# Altium schematic sheet Connectors.SchDoc: Heater Test Board
size OrCAD A; DocumentNumber: LM-HTR-001-TEST; Revision: A; SheetNumber: 1; SheetTotal: 2
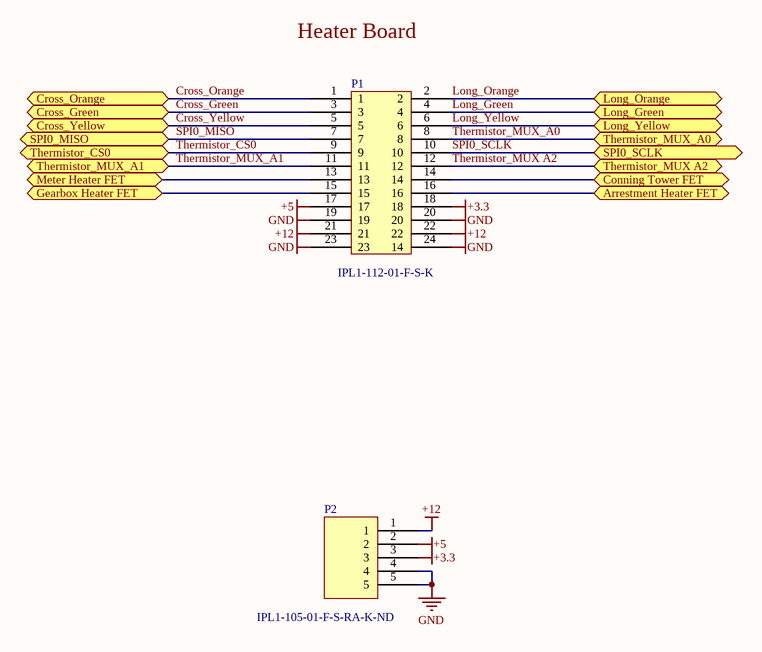
[diagram p0: Connectors.SchDoc]

## Parts
P1  IPL1-112-01-F-S-K  [IPL1-112-01-F-S-K]
P2  Supplier Part Number 1: IPL1-105-01-F-S-RA-K-ND  [IPL1-105-01-F-S-RA]  (hidden comment: IPL1-105-01-F-S-RA)

## Ports
Arrestment Heater FET, Conning Tower FET, Cross_Green, Cross_Orange, Cross_Yellow, Gearbox Heater FET, Long_Green, Long_Orange, Long_Yellow, Meter Heater FET, SPI0_MISO, SPI0_SCLK, Thermistor_CS0, Thermistor_MUX A2, Thermistor_MUX_A0, Thermistor_MUX_A1

## Nets
+3.3: P1.18 P2.3
+5: P1.17 P2.2
+12: P1.21 P1.22 P2.1
GND: P1.19 P1.20 P1.23 P1.24(14) P2.4 P2.5
Arrestment Heater FET: P1.16 ; port Arrestment Heater FET
Conning Tower FET: P1.14 ; port Conning Tower FET
Cross_Green: P1.3 ; port Cross_Green
Cross_Orange: P1.1 ; port Cross_Orange
Cross_Yellow: P1.5 ; port Cross_Yellow
Gearbox Heater FET: P1.15 ; port Gearbox Heater FET
Long_Green: P1.4 ; port Long_Green
Long_Orange: P1.2 ; port Long_Orange
Long_Yellow: P1.6 ; port Long_Yellow
Meter Heater FET: P1.13 ; port Meter Heater FET
SPI0_MISO: P1.7 ; port SPI0_MISO
SPI0_SCLK: P1.10 ; port SPI0_SCLK
Thermistor_CS0: P1.9 ; port Thermistor_CS0
Thermistor_MUX A2: P1.12 ; port Thermistor_MUX A2
Thermistor_MUX_A0: P1.8 ; port Thermistor_MUX_A0
Thermistor_MUX_A1: P1.11 ; port Thermistor_MUX_A1

## Notes on the sheet
- Heater Board
- Title
- Size:
- Date:
- Orcad A
- Number:
- Time:
- Revision:
- Sheet
- of
- ZLS Corporation
- 7801 North Lamar Blvd.
- Suite E-184
- Austin, Texas 78752  USA
- (512) 453-0288
- File:

## Library data of the parts
P1 = IPL1-112-01-F-S-K: IPL1-112-01-F-D-K; Manufacturer: Samtec; Number of Contacts: 12; Gender: Male; Pitch: 2.54mm; Supplier 1: Newark; Supplier Part Number 1: 08W3504; Supplier 2: Avnet; Supplier Part Number 2: IPL1-112-01-F-S-K; Manufacturer Part Number: IPL1-112-01-F-S-K; Stock 2: 0; Mount: Through Hole; Packaging: Bulk; Termination: Solder; Orientation: Straight; Radiation Hardening: No; ComponentLink1URL: https://datasheet.ciiva.com/9444/ipl1-9444389.pdf; ComponentLink1Description: https://datasheet.ciiva.com/9444/ipl1-9444389.pdf
P2 = IPL1-105-01-F-S-RA: Supplier 1: Digi-Key